# EAGLE design Motherboard (EAGLE 7.6.0)
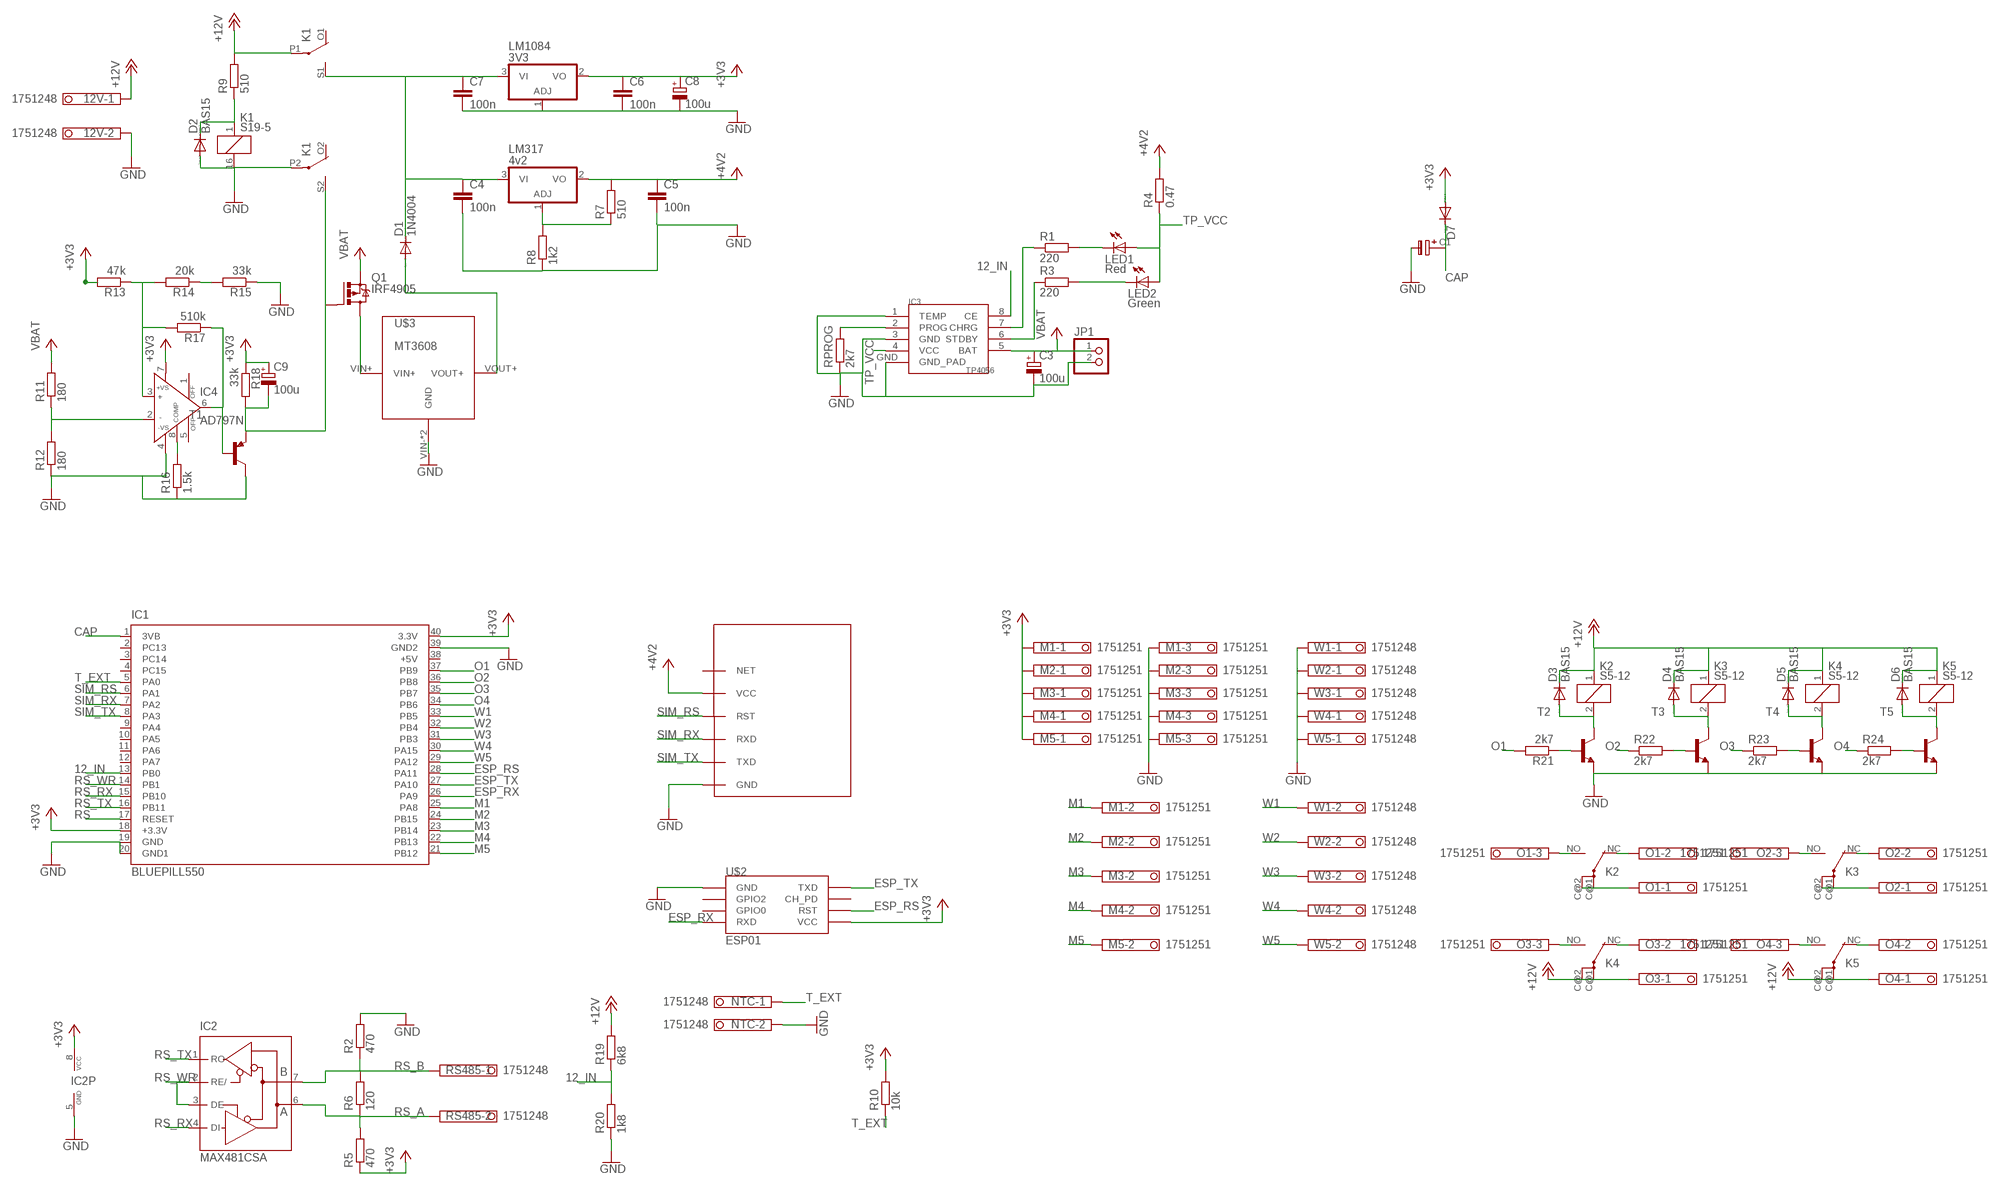
[diagram p0: schematic, sheet 1]

## Parts
12V  1751248  [1751248]
C1  CAP-13,5  [PAC-G-1]
C3  100u  CPOL-EUE2,5-6E  [E2,5-6E]
C4  100n  C-EUC2012  [C2012]
C5  100n  C-EUC2012  [C2012]
C6  100n  C-EUC2012  [C2012]
C7  100n  C-EUC2012  [C2012]
C8  100u  CPOL-EUE2,5-6E  [E2,5-6E]
C9  100u  CPOL-EUE2,5-6E  [E2,5-6E]
D1  1N4004  [DO41-10]
D2  BAS15  [DO34-7]
D3  BAS15  [DO34-7]
D4  BAS15  [DO34-7]
D5  BAS15  [DO34-7]
D6  BAS15  [DO34-7]
D7  BAS15  [DO34-7]
IC1  BLUEPILL550  [DIL40]
IC2  MAX481CSA  [SO08]
IC3  TP4056  [SOP-8]
IC4  AD797N  [DIL08]
JP1  PINHD-1X2  [1X02]
K1  S19-5  351  [351]
K2  S5-12  HY1-5V  [HY]
K3  S5-12  HY1-5V  [HY]
K4  S5-12  HY1-5V  [HY]
K5  S5-12  HY1-5V  [HY]
LED1  Red  LEDCHIP-LED0805  [CHIP-LED0805]
LED2  Green  LEDCHIP-LED0805  [CHIP-LED0805]
LM317  4v2  317T  [TO220H]
LM1084  3V3  317T  [TO220H]
M1  1751251  [1751251]
M2  1751251  [1751251]
M3  1751251  [1751251]
M4  1751251  [1751251]
M5  1751251  [1751251]
NTC  1751248  [1751248]
O1  1751251  [1751251]
O2  1751251  [1751251]
O3  1751251  [1751251]
O4  1751251  [1751251]
Q1  IRF4905  [TO220BH]
R1  220  R-EU_R0805  [R0805]
R2  470  R-EU_0204/5  [0204/5]
R3  220  R-EU_R0805  [R0805]
R4  0.47  R-EU_0207/12  [0207/12]
R5  470  R-EU_0204/5  [0204/5]
R6  120  R-EU_0204/7  [0204/7]
R7  510  R-EU_0204/7  [0204/7]
R8  1k2  R-EU_0204/7  [0204/7]
R9  510  R-EU_0204/7  [0204/7]
R10  10k  R-EU_0204/5  [0204/5]
R11  180  R-EU_0204/7  [0204/7]
R12  180  R-EU_0204/7  [0204/7]
R13  47k  R-EU_0204/7  [0204/7]
R14  20k  R-EU_0204/7  [0204/7]
R15  33k  R-EU_0204/7  [0204/7]
R16  1.5k  R-EU_0204/7  [0204/7]
R17  510k  R-EU_0204/7  [0204/7]
R18  33k  R-EU_0204/7  [0204/7]
R19  6k8  R-EU_0204/5  [0204/5]
R20  1k8  R-EU_0204/5  [0204/5]
R21  2k7  R-EU_0204/7  [0204/7]
R22  2k7  R-EU_0204/7  [0204/7]
R23  2k7  R-EU_0204/7  [0204/7]
R24  2k7  R-EU_0204/7  [0204/7]
RPROG  2k7  R-EU_0204/7  [0204/7]
RS485  1751248  [1751248]
T1  BC327-40-PNP-TO92-EBC  [TO92-EBC]
T2  -NPN-TO92-ECB  [TO92-ECB]
T3  -NPN-TO92-ECB  [TO92-ECB]
T4  -NPN-TO92-ECB  [TO92-ECB]
T5  -NPN-TO92-ECB  [TO92-ECB]
U$1  SIM800L  [SIM-CORE]
U$2  ESP01  [ESP01]
U$3  MT3608  [MT3608]
W1  1751248  [1751248]
W2  1751248  [1751248]
W3  1751248  [1751248]
W4  1751248  [1751248]
W5  1751248  [1751248]

## Nets
4V2: C5.1 LM317.2(VO) R4.2 R7.2 U$1.VCC ; supply symbol labelled +4V2
12_IN: IC1.13(PB0) IC3.8(CE) R19.1 R20.2
+3V3: C6.1 C8.+ C9.+ D7.A IC1.18(+3.3V) IC1.40(3.3V) IC2.8(VCC) IC4.7(+VS) LM1084.2(VO) M1.1 M2.1 M3.1 M4.1 M5.1 R5.1 R10.2 R13.2 R18.1 U$2.VCC
+12V: 12V.1 D3.C D4.C D5.C D6.C K1.P1(2:P) K2.1 K3.1 K4.1 K4.C@1(2:P) K4.C@2(2:P) K5.1 K5.C@1(2:P) K5.C@2(2:P) O3.1 O4.1 R9.2 R19.2
CAP: C1.+ D7.C IC1.1(3VB)
ESP_RS: IC1.28(PA11) U$2.RST
ESP_RX: IC1.26(PA9) U$2.RX(RXD)
ESP_TX: IC1.27(PA10) U$2.TX(TXD)
GND: 12V.2 C1.- C3.- C4.2 C5.2 C6.2 C7.2 C8.- D2.A IC1.19(GND) IC1.20(GND1) IC1.39(GND2) IC2.5(GND) IC3.1(TEMP) IC3.3(GND) IC3.GND(GND_PAD) IC4.4(-VS) JP1.2 K1.16 K1.P2(3:P) LM1084.1(ADJ) M1.3 M2.3 M3.3 M4.3 M5.3 NTC.2 R2.2 R8.1 R12.1 R15.1 R16.1 R20.1 RPROG.1 T1.C T2.E T3.E T4.E T5.E U$1.GND U$2.GND U$3.VIN-(GND) U$3.VOUT-(GND) W1.1 W2.1 W3.1 W4.1 W5.1
M1: IC1.25(PA8) M1.2
M2: IC1.24(PB15) M2.2
M3: IC1.23(PB14) M3.2
M4: IC1.22(PB13) M4.2
M5: IC1.21(PB12) M5.2
N$1: IC3.2(PROG) RPROG.2
N$2: D2.C K1.1 R9.1
N$3: LED1.C R1.2
N$4: LED2.C R3.2
N$5: IC3.7(CHRG) R1.1
N$6: IC3.6(STDBY) R3.1
N$7: C4.1 C7.1 D1.C K1.S1(2:S) LM317.3(VI) LM1084.3(VI)
N$8: Q1.D U$3.VIN+
N$9: IC4.3(IN+) R13.1 R14.2 R17.2
N$11: IC4.2(IN-) R11.1 R12.2
N$12: IC4.8(COMP) R16.2
N$13: IC4.6(OUT) R17.1 T1.B
N$14: LM317.1(ADJ) R7.1 R8.2
N$15: C9.- K1.S2(3:S) Q1.G R18.2 T1.E
N$19: R24.2 T5.B
N$20: R23.2 T4.B
N$21: R22.2 T3.B
N$22: R21.1 T2.B
N$23: K4.NO(2:S) O3.3
N$24: K4.NC(2:O) O3.2
N$25: K5.NO(2:S) O4.3
N$26: K5.NC(2:O) O4.2
N$27: K2.NO(2:S) O1.3
N$28: K2.C@1(2:P) K2.C@2(2:P) O1.1
N$29: K2.NC(2:O) O1.2
N$30: K3.NO(2:S) O2.3
N$31: K3.NC(2:O) O2.2
N$32: K3.C@1(2:P) K3.C@2(2:P) O2.1
N$33: R14.1 R15.2
N$34: D6.A K5.2 T5.C
N$35: D3.A K2.2 T2.C
N$36: D4.A K3.2 T3.C
N$37: D5.A K4.2 T4.C
O1: IC1.37(PB9) R21.2
O2: IC1.36(PB8) R22.1
O3: IC1.35(PB7) R23.1
O4: IC1.34(PB6) R24.1
RS: IC1.17(RESET)
RS_A: IC2.6(A) R5.2 R6.1 RS485.2
RS_B: IC2.7(B) R2.1 R6.2 RS485.1
RS_RX: IC1.15(PB10) IC2.4(DI)
RS_TX: IC1.16(PB11) IC2.1(RO)
RS_WR: IC1.14(PB1) IC2.2(RE/) IC2.3(DE)
SIM_RS: IC1.6(PA1) U$1.RST
SIM_RX: IC1.7(PA2) U$1.RXD
SIM_TX: IC1.8(PA3) U$1.TXD
T_EXT: IC1.5(PA0) NTC.1 R10.1
TP_VCC: IC3.4(VCC) LED1.A LED2.A R4.1
VBAT: C3.+ IC3.5(BAT) JP1.1 Q1.S R11.2
VOUT+: D1.A U$3.VOUT+
W1: IC1.33(PB5) W1.2
W2: IC1.32(PB4) W2.2
W3: IC1.31(PB3) W3.2
W4: IC1.30(PA15) W4.2
W5: IC1.29(PA12) W5.2
Unconnected: IC1.2(PC13) IC1.3(PC14) IC1.4(PC15) IC1.9(PA4) IC1.10(PA5) IC1.38(+5V) IC4.1(OFF) IC4.5(OFF) K1.O1(2:O) K1.O2(3:O) U$1.NET U$2.CH_PD U$2.GPIO0 U$2.GPIO2

## Power pins joined to a net without a drawn wire
PA6: IC1.11(PA6)
PA7: IC1.12(PA7)

## Library data of the parts
12V NTC RS485 W1-W5 = con-phoenix-350:1751248: MKDS 1/ 2-3,5 Printklemme Nennstrom: 10 A Bemessungsspannung: 160 V Raster: 3,5 mm Polzahl: 2 Montageart: Löten Anschlussart: Schraubanschluss Anschlussrichtung vom Leiter zur Platine: 0° Source: http://eshop.phoenixcontact.com .. 1751248.pdf; OC_FARNELL: unknown; OC_NEWARK: unknown
C1 = Cap-Gold:CAP-13,5
C3 C8 C9 = resistor:CPOL-EU: POLARIZED CAPACITOR, European symbol
C4-C7 = resistor:C-EU: CAPACITOR, European symbol
D1 = diode:1N4004: DIODE general purpose rectifier, 1 A
D2-D7 = diode:BAS15: DIODE high speed
IC1 = STM32BluePill:BLUEPILL: BluePill STM32F108T6 Dev Board Source: http://www.stm32duino.com; 0: x; BLUEP: 1; MF: BluePill; MPN: BluePill; X: 0
IC2 = maxim:MAX481CSA: RS485 TRANSEIVER; MF: MAXIM; MPN: MAX481CSA; OC_FARNELL: unknown; OC_NEWARK: 90C3817
IC3 = TP4056_2:TP4056
IC4 = analog-devices:AD797: Ultralow Distortion, Ultralow Noise Op Amp Source: http://www.analog.com/static/imported-files/data_sheets/AD797.pdf; MF: ALTERA CORPORATION; MPN: AD797ANZ; OC_FARNELL: 9603778; OC_NEWARK: 59K6088
JP1 = pinhead:PINHD-1X2: PIN HEADER
K1 = relay:351: RELAY 2 x switch, Omron; OC_FARNELL: unknown; OC_NEWARK: unknown
K2-K5 = relay:HY1*: Non-polarized 1 Form C Relay NAiS Source: http://www.mew-europe.com/.. en_ds_61012_0000.pdf; MF: AROMAT/ MATSUSHITA; MPN: HY1-5V; OC_FARNELL: unknown; OC_NEWARK: 10C6692
LED1 LED2 = led:LED: LED OSRAM: - CHIPLED LG R971, LG N971, LY N971, LG Q971, LY Q971, LO R971, LY R971 LH N974, LH R974 LS Q976, LO Q976, LY Q976 LO Q996 - Hyper CHIPLED LW Q18S LB Q993, LB Q99A, LB R99A - SideLED LS A670, LO A670, LY A670, LG A670, LP A670 LB A673, LV A673, LT A673, LW A673 LH A674 LY A675 LS A676, LA A676, LO A676, LY A676, LW A676 LS A679, LY A679, LG A679 - Hyper Micro SIDELED® LS Y876, LA Y876, LO Y876, LY Y876 LT Y87S - SmartLED LW L88C, LW L88S LB L89C, LB L89S, LG L890 LS L89K, LO L89K, LY L89K LS L896, LA L896, LO L896, LY L896 - TOPLED LS T670, LO T670, LY T670, LG T670, LP T670 LSG T670, LSP T670, LSY T670, LOP T670, LYG T670 LG T671, LOG T671, LSG T671 LB T673, LV T673, LT T673, LW T673 LH T674 LS T676, LA T676, LO T676, LY T676, LB T676, LH T676, LSB T676, LW T676 LB T67C, LV T67C, LT T67C, LS T67K, LO T67K, LY T67K, LW E67C LS E67B, LA E67B, LO E67B, LY E67B, LB E67C, LV E67C, LT E67C LW T67C LS T679, LY T679, LG T679 LS T770, LO T770, LY T770, LG T770, LP T770 LB T773, LV T773, LT T773, LW T773 LH T774 LS E675, LA E675, LY E675, LS T675 LS T776, LA T776, LO T776, LY T776, LB T776 LHGB T686 LT T68C, LB T68C - Hyper Mini TOPLED® LB M676 - Mini TOPLED Santana® LG M470 LS M47K, LO M47K, LY M47K Source: http://www.osram.convergy.de LUXEON: - LUMILED® LXK2-PW12-R00, LXK2-PW12-S00, LXK2-PW14-U00, LXK2-PW14-V00 LXK2-PM12-R00, LXK2-PM12-S00, LXK2-PM14-U00 LXK2-PE12-Q00, LXK2-PE12-R00, LXK2-PE12-S00, LXK2-PE14-T00, LXK2-PE14-U00 LXK2-PB12-K00, LXK2-PB12-L00, LXK2-PB12-M00, LXK2-PB14-N00, LXK2-PB14-P00, LXK2-PB14-Q00 LXK2-PR12-L00, LXK2-PR12-M00, LXK2-PR14-Q00, LXK2-PR14-R00 LXK2-PD12-Q00, LXK2-PD12-R00, LXK2-PD12-S00 LXK2-PH12-R00, LXK2-PH12-S00 LXK2-PL12-P00, LXK2-PL12-Q00, LXK2-PL12-R00 Source: www.luxeon.com KINGBRIGHT: KA-3528ASYC Source: www.kingbright.com
LM317 LM1084 = linear:*317: Positive VOLTAGE REGULATOR
M1-M5 O1-O4 = con-phoenix-350:1751251: MKDS 1/ 3-3,5 Printklemme Nennstrom: 10 A Bemessungsspannung: 160 V Raster: 3,5 mm Polzahl: 3 Montageart: Löten Anschlussart: Schraubanschluss Anschlussrichtung vom Leiter zur Platine: 0° Source: http://eshop.phoenixcontact.com .. 1751251.pdf; OC_FARNELL: unknown; OC_NEWARK: unknown
Q1 = transistor-power:IRF4905: P-Channel HEXFET® Power MOSFET RDS(on)= 0.02 Ohm, ID = -74A Source: http://www.irf.com/product-info/datasheets/data/irf4905pbf.pdf
R1-R9 R11-R18 R21-R24 RPROG = resistor:R-EU_: RESISTOR, European symbol
R10 R19 R20 = rcl:R-EU_: RESISTOR, European symbol
T1 = transistor:*-PNP-: PNP Transistror
T2-T5 = transistor:*-NPN-: NPN Transistror BF959 corrected 2008.03.06
U$1 = SIM800L:SIM800L
U$2 = ESP_8266:ESP01: ESP8266 Wifi module 01
U$3 = dc-dc-converter2:MT3608

## Board
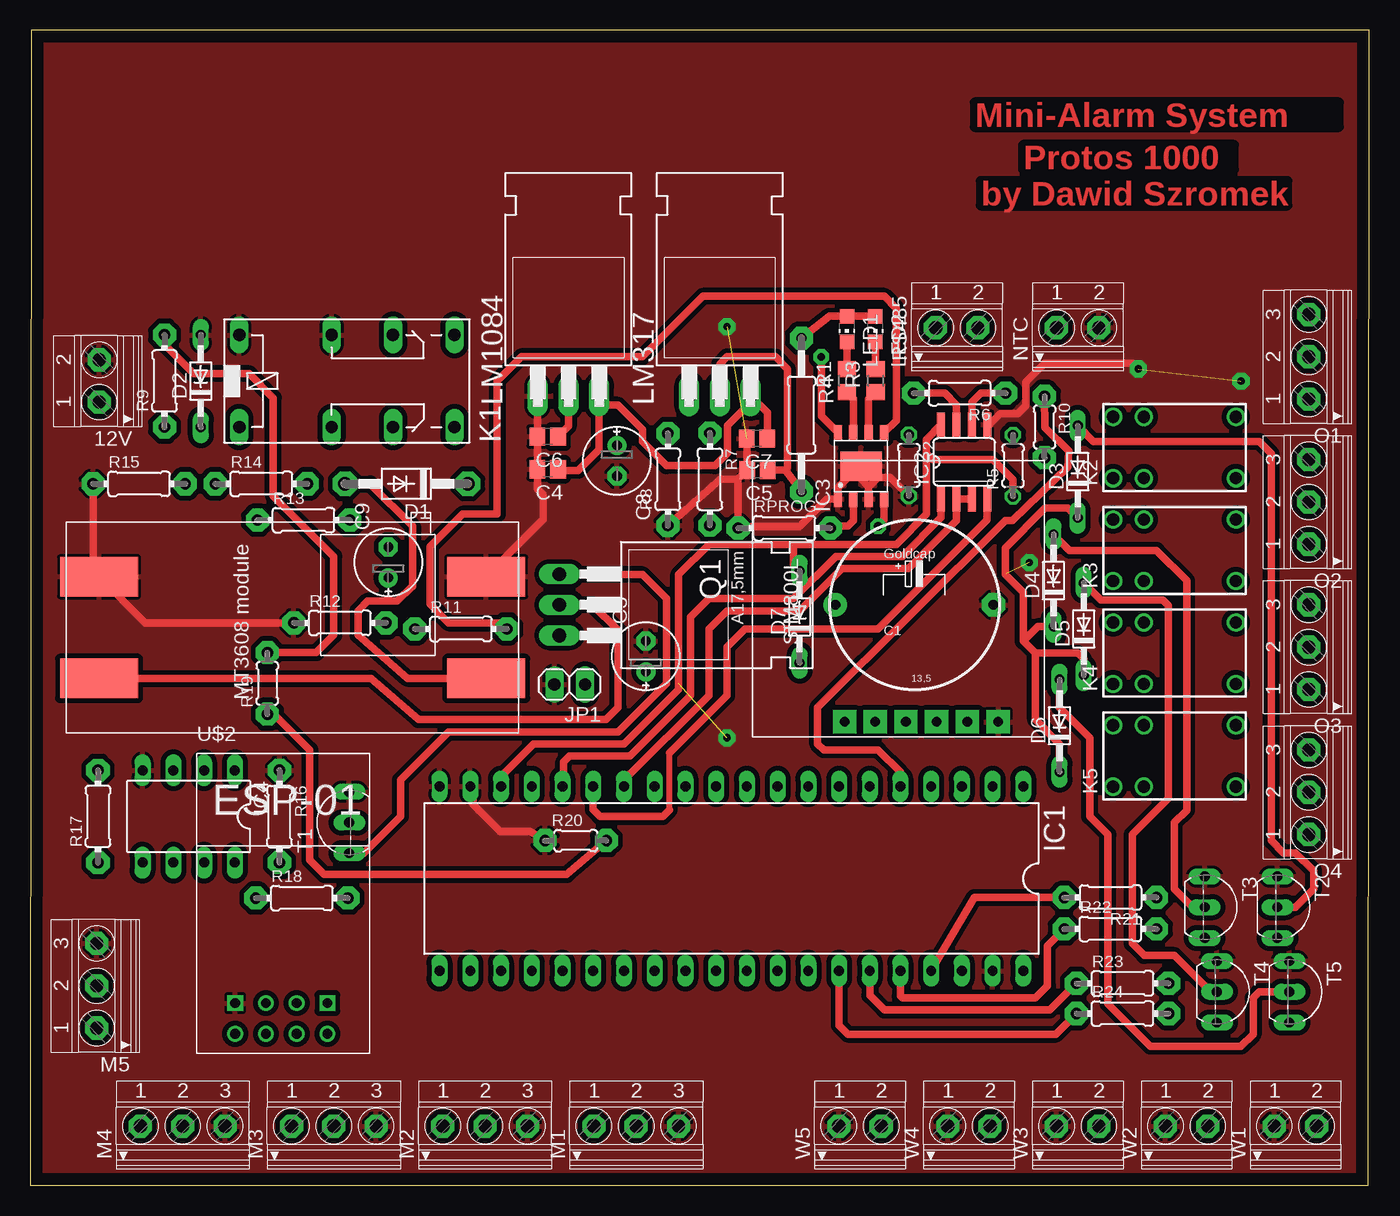
[diagram p1: board, top side]
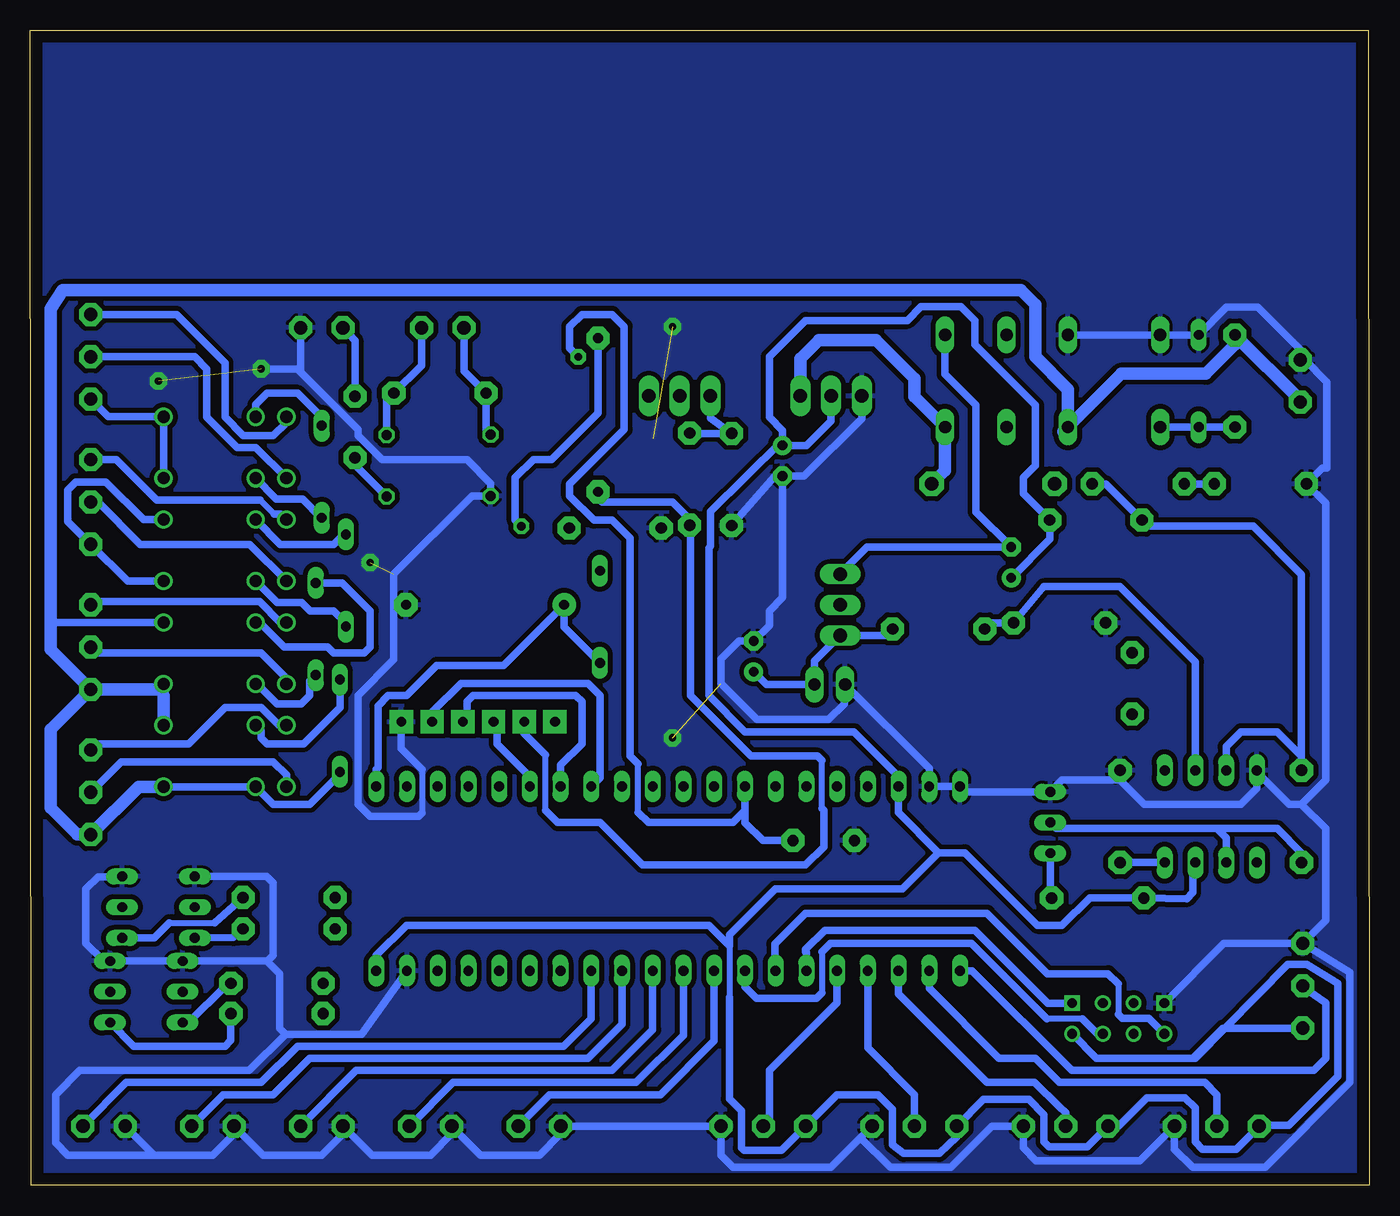
[diagram p2: board, bottom side, seen from below]

Size 110.7 x 95.5 mm. Coordinates in mm from the lower left corner, seen from the top.
Outline: 0,0 110.6,0 110.7,95.5 0.1,95.5 0,0
Copper layers (1*16): Top 0.035mm / dielectric 1.5mm / Bottom 0.035mm
Design rules "default": minimum track width 10mil, minimum drill 24mil, track to track 8mil, track to pad 8mil, pad to pad 8mil, via to via 8mil, smd to smd 8mil, copper to edge 40mil, drill to drill 8mil, minimum pad ring 10mil, minimum via ring 8mil, stop-mask expansion 4mil, vias tented up to drill 0mil, thermal gap 10mil

### Footprints (pad centres in the part's own frame; a part is rotated, then mirrored left to right if it is on the bottom)
1751248 = drill 1.1 pad 1.905 octagon: 1 -1.75,-0.1; 2 1.75,-0.1
PAC-G-1 = drill 0.813 pad 1.93: + -6.54,0 | drill 0.813 pad 1.93 octagon: - 6.54,0
E2,5-6E = drill 0.813 pad 1.575: + -1.27,0 | drill 0.813 pad 1.575 octagon: - 1.27,0
C2012 = smd 1.3 x 1.5: 1 -0.85,0; 2 0.85,0
DO41-10 = drill 1.118 pad 2.032 octagon: A 5.08,0; C -5.08,0
DO34-7 = drill 0.813 long: A 3.81,0; C -3.81,0
DIL40 = drill 0.813 long: 1 -24.13,-7.62; 2 -21.59,-7.62; 3 -19.05,-7.62; 4 -16.51,-7.62; 5 -13.97,-7.62; 6 -11.43,-7.62; 7 -8.89,-7.62; 8 -6.35,-7.62; 9 -3.81,-7.62; 10 -1.27,-7.62; 11 1.27,-7.62; 12 3.81,-7.62; 13 6.35,-7.62; 14 8.89,-7.62; 15 11.43,-7.62; 16 13.97,-7.62; 17 16.51,-7.62; 18 19.05,-7.62; 19 21.59,-7.62; 20 24.13,-7.62; 21 24.13,7.62; 22 21.59,7.62; 23 19.05,7.62; 24 16.51,7.62; 25 13.97,7.62; 26 11.43,7.62; 27 8.89,7.62; 28 6.35,7.62; 29 3.81,7.62; 30 1.27,7.62; 31 -1.27,7.62; 32 -3.81,7.62; 33 -6.35,7.62; 34 -8.89,7.62; 35 -11.43,7.62; 36 -13.97,7.62; 37 -16.51,7.62; 38 -19.05,7.62; 39 -21.59,7.62; 40 -24.13,7.62
SO08 = smd 0.66 x 2.032: 1 -1.905,-3.073; 2 -0.635,-3.073; 3 0.635,-3.073; 4 1.905,-3.073; 5 1.905,3.073; 6 0.635,3.073; 7 -0.635,3.073; 8 -1.905,3.073
SOP-8 = smd 1.3 x 0.7: 1 -2.75,1.905; 2 -2.75,0.635; 3 -2.75,-0.635; 4 -2.75,-1.905; 5 2.75,-1.905; 6 2.75,-0.635; 7 2.75,0.635; 8 2.75,1.905 | smd 2.413 x 3.429: GND 0,0
DIL08 = drill 0.813 long: 1 -3.81,-3.81; 2 -1.27,-3.81; 3 1.27,-3.81; 4 3.81,-3.81; 5 3.81,3.81; 6 1.27,3.81; 7 -1.27,3.81; 8 -3.81,3.81
1X02 = drill 1.016 long: 1 -1.27,0; 2 1.27,0
351 = drill 1.016 long: 1 -3.81,-3.81; 16 -3.81,3.81; O1 8.89,-3.81; O2 8.89,3.81; P1 3.81,-3.81; P2 3.81,3.81; S1 13.97,-3.81; S2 13.97,3.81
HY = drill 1: 1 -2.54,-2.54; 2 -2.54,2.54; C@1 5.08,2.54; C@2 5.08,-2.54; NC -5.08,-2.54; NO -5.08,2.54
CHIP-LED0805 = smd 1.2 x 1.2: A 0,-1.05; C 0,1.05
TO220H = drill 1.118 long: 1 -2.54,-10.16; 2 0,-10.16; 3 2.54,-10.16
1751251 = drill 1.1 pad 1.905 octagon: 1 -3.5,-0.1; 2 0,-0.1; 3 3.5,-0.1
TO220BH = drill 1.118 long: D 0,-6.35; G -2.54,-6.35; S 2.54,-6.35
R0805 = smd 1.3 x 1.5: 1 -0.95,0; 2 0.95,0
0204/5 = drill 0.813 octagon: 1 -2.54,0; 2 2.54,0
0207/12 = drill 0.813 pad 1.905 octagon: 1 -6.35,0; 2 6.35,0
0204/7 = drill 0.94 pad 1.905 octagon: 1 -3.81,0; 2 3.81,0
0204/5' = drill 0.94 pad 1.905 octagon: 1 -2.54,0; 2 2.54,0
TO92-EBC = drill 0.813 long: B 0,-1.27; C 2.54,-1.27; E -2.54,-1.27
TO92-ECB = drill 0.813 long: B 2.54,0; C 0,0; E -2.54,0
SIM-CORE = drill 0.8 pad 1.93 square: GND 1.27,3.81; NET 1.27,16.51; RST 1.27,11.43; RXD 1.27,8.89; TXD 1.27,6.35; VCC 1.27,13.97
ESP01 = drill 0.8: CH_PD -1.285,-8.178; GPIO0 1.255,-5.638; GPIO2 -1.285,-5.638; RST 1.255,-8.178; TX -3.825,-8.178; VCC 3.795,-8.178 | drill 0.8 square: GND -3.825,-5.638; RX 3.795,-5.638
MT3608 = smd 3.251 x 6.452: VIN+ -4.2,16; VIN- 4.2,16; VOUT+ -4.2,-16; VOUT- 4.2,-16

### Placement (x,y rotation side)
12V  5.6,66.5 90 top
C1  73.1,48 0 top
C3  50.89,43.73 90 top
C4  42.78,59.2 180 top
C5  60.13,59.15 180 top
C6  42.78,61.9 180 top
C7  60.08,61.75 180 top
C8  48.5,59.91 270 top
C9  29.6,51.5 90 top
D1  31.1,58 180 top
D2  14.1,66.5 90 top
D3  86.6,59 90 top
D4  84.6,50 90 top
D5  87.1,46 90 top
D6  85.1,38 90 top
D7  63.6,47 90 top
IC1  57.97,25.36 180 top
IC2  77.21,59.81 0 top
IC3  68.68,59.47 90 top
IC4  13.1,30.5 180 top
JP1  44.6,41.41 180 top
K1  21.1,66.5 0 top
K2  94.6,61 0 top
K3  94.6,52.5 0 top
K4  94.6,44 0 top
K5  94.6,35.5 0 top
LED1  67.52,70.8 180 top
LED2  69.87,70.8 180 top
LM317  57.01,75.43 0 top
LM1084  44.5,75.43 0 top
M1  50.1,5 0 top
M2  37.6,5 0 top
M3  25.1,5 0 top
M4  12.6,5 0 top
M5  5.4,16.5 90 top
NTC  86.6,71 0 top
O1  105.6,68.5 90 top
O2  105.6,56.5 90 top
O3  105.6,44.5 90 top
O4  105.6,32.5 90 top
Q1  50.1,48 270 top
R1  67.51,66.53 90 top
R2  72.63,59.53 270 top
R3  69.89,66.53 90 top
R4  63.76,63.69 270 top
R5  81.25,59.5 90 top
R6  76.83,65.5 180 top
R7  56.19,58.39 270 top
R8  52.72,58.36 90 top
R9  11.1,66.5 90 top
R10  10k  [0204/5']  83.85,62.7 270 top
R11  35.6,46 0 top
R12  25.6,46.5 0 top
R13  22.6,55 0 top
R14  19.1,58 0 top
R15  9,58 0 top
R16  20.6,30.5 270 top
R17  5.6,30.5 90 top
R18  22.45,23.75 0 top
R19  6k8  [0204/5']  19.6,41.5 90 top
R20  1k8  [0204/5']  45.1,28.5 0 top
R21  89.3,23.8 180 top
R22  89.3,21.2 0 top
R23  90.3,16.7 0 top
R24  90.3,14.2 0 top
RPROG  62.34,54.34 0 top
RS485  76.6,71 0 top
T1  25.1,30 90 top
T2  103.1,23 270 top
T3  97.1,23 270 top
T4  98.1,16 270 top
T5  104.1,16 270 top
U$1  83.83,37.06 90 top
U$2  20.77,20.7 0 top
U$3  21.69,46.12 90 top
W1  104.6,5 0 top
W2  95.6,5 0 top
W3  86.6,5 0 top
W4  77.6,5 0 top
W5  68.6,5 0 top

### Tracks (layer width: path | path; a pad name or v marks a point on that pad's centre or on a via)
4V2
  Top 0.61: R4.2 62.45,59.15 | 62.45,59.15 C5.1 | LM317.2 57.01,67.91 57.6,68.5 61.6,68.5 62.6,67.5 62.6,59.3 62.45,59.15
  Bottom 0.508: 68.1,31 68.1,35.6 | 45.25,31.15 45.25,35.15
  Bottom 0.61: R7.2 55.99,54.89 57.6,56.5 63.42,56.5 R4.2 | R7.2 55.99,54.42 | 68.1,35.6 69.86,37.36 U$1.VCC | 68.1,31 67.1,30 63.6,30 60.1,26.5 46.6,26.5 45.1,28 45.1,31 45.25,31.15 | 45.25,35.15 45.6,35.5 51.1,35.5 56.1,40.5 56.1,54.42 R7.2
12_IN  (via drill 0.6 pad 1.27)
  Top 0.61: R19.1 20.14,38.96 23.1,36 23.1,26.9 24.3,25.7 44.34,25.7 R20.2 | v65.4,68.5 65.4,63.59 IC3.8
  Bottom 0.508: 60.45,30.85 60.45,34.85
  Bottom 0.61: R20.2 50.14,28.5 51.62,29.98 IC1.13 51.6,32.96 51.6,31 52.6,30 59.6,30 60.45,30.85 | 60.45,34.85 61.1,35.5 61.1,53.5 62.6,55 64.1,55 66.1,57 66.1,58 61.6,62.5 61.6,71 62.6,72 65.1,72 66.1,71 66.1,69.2 v65.4,68.5
+3V3
  Top 0.61: LM1084.2 44.5,62.77 C6.1 | IC2.8 74.1,61.68 74.1,60.5 | 74.1,60.5 74.1,55.5 71.6,53 63.1,53 | 63.1,53 56.1,53 53.6,50.5 53.6,41 49.1,36.5 41.6,36.5 38.92,33.82 IC1.18 | R5.1 81.25,58.35 79.6,60 74.6,60 74.1,60.5 | D7.A 63.1,51.31 63.1,53
  Bottom 0.508: 52.9,19.8 52.9,15.49
  Bottom 0.61: C8.+ 46.52,61.18 44.5,63.2 LM1084.2 | C9.+ 26.41,53.42 R13.2 28.6,57.19 28.6,58.5 27.6,59.5 27.6,64.5 32.6,69.5 32.6,71.5 33.75,72.65 37.05,72.65 38.2,71.5 46.6,71.5 49.6,68.5 49.6,63.5 48.5,62.4 C8.+ | IC4.7 14.6,26.46 14.6,24.2 15.1,23.7 R18.1 23.1,23.75 25.4,21.5 27.44,21.5 33.44,27.5 35.6,27.5 | U$2.VCC 22.54,10.5 14.6,10.5 | 14.6,10.5 12.1,13 M5.1 | 35.6,27.5 38.92,30.82 IC1.18 38.92,33.82 42.6,37.5 51.6,37.5 54.6,40.5 54.6,52.7 54.45,52.85 54.45,55.7 48.6,61.5 48.6,61.28 C8.+ | 52.9,15.49 52.91,15.54 52.9,7.15 51.9,6.15 51.9,3.1 51.7,2.9 48.6,2.9 M1.1 44,7.5 40.6,7.5 39.4,6.3 39.4,3.35 38.5,2.65 35.55,2.65 34.1,4 M2.1 31.9,7.1 28.15,7.1 26.9,5.85 26.9,3.6 26.5,3.2 23.3,3.2 M3.1 20.75,4.9 18.4,7.25 15.25,7.25 14.4,6.4 14.4,3.6 13.8,3 11,3 M4.1 9.05,4.95 6.65,4.95 2.6,9 2.6,16.7 5.15,18.25 6.75,18.25 14.4,10.5 14.6,10.5 | IC1.40 82.1,19 79.6,21.5 54.6,21.5 52.9,19.8 52.9,20.7 49.1,24.5 38.6,24.5 35.6,27.5 | R10.2 83.85,59.56 R5.1
+12V
  Top 0.61: R19.2 23.64,44.04 25.1,45.5 25.1,52 20.1,57 20.1,65.1 18.1,67.1 13.5,67.1 11.1,69.5 R9.2 | D3.C 85.79,56 83.9,56 80.6,52.7 80.6,50.5 82.1,49 82.1,45 | D4.C 83.29,46.19 82.1,45 | 82.1,45 83.1,44 | 83.1,44 86.6,44 87.1,43.5 D5.C | D6.C 85.1,36.5 83.1,38.5 83.1,44
  Bottom 0.61: 12V.1 5.7,64.91 | R9.2 11.1,69.5 | 100.14,41 100.2,41 99.68,40.48 | K4.C@1 108.96,46.54 109,46.5 | D3.C 86.64,55.19 88.2,56.75 90.35,56.75 K2.1 | K3.1 90.3,48.2 88.25,48.2 87.55,47.5 85.6,47.5 84.6,46.5 D4.C | K4.1 91.96,41.46 90.3,39.8 88.3,39.8 87.6,40.5 87.6,41.69 D5.C | D6.C 85.1,34 87.6,31.5 90.6,31.5 K5.1 K5.C@2
  Bottom 1.016: 5.7,64.91 R9.2 | 11.1,69.5 13.5,67.1 20.5,67.1 K1.P1 | 25.3,62.3 K1.P1 | K1.P1 24.91,65.81 27.6,68.5 27.6,72.8 28.8,74 108,74 109,72.5 109,46.5 109,44.3 O3.1 | O3.1 100.2,41 | 100.14,41 K4.C@2 | O3.1 109,37.7 109,31.2 106.8,29 O4.1 101.74,32.96 K5.C@2 | K5.C@1 99.68,40.48
CAP
  Bottom 0.61: IC1.1 82.1,34.4 81.95,34.55 81.95,39.65 81.1,40.5 79.6,40.5 77.1,43 71.56,43 C1.+ 66.56,46.15 D7.C
ESP_RS
  Bottom 0.508: 23.7,13.75 26.65,13.75 | 45.25,19.3 45.25,15.9
  Bottom 0.61: U$2.RST 22.47,12.52 23.7,13.75 | 26.65,13.75 32.9,20 44.55,20 45.25,19.3 | 45.25,15.9 45.7,15.45 50.65,15.45 51.6,16.4 51.6,17.72 IC1.28
ESP_RX
  Bottom 0.61: IC1.26 46.54,19.26 46.6,19.32 46.6,19.5 45,21.1 32.6,21.1 26.57,15.06 U$2.RX
ESP_TX
  Bottom 0.508: 20.75,16.65 20.75,14.15
  Bottom 0.61: U$2.TX 18.22,13.8 20.4,13.8 20.75,14.15 | IC1.27 49.15,17.81 49.15,19.95 46.6,22.5 31.6,22.5 26.6,17.5 21.6,17.5 20.75,16.65
GND  (via drill 0.6 pad 1.42)  (4 unrouted)
  Top 0.61: 4.79,51.22 5.19,50.82 | 5.19,50.82 U$3.VIN- 9.51,46.5 R12.1 | LM1084.1 41.96,61.93 C6.2 C4.2 41.93,57.57 42.4,57.1 42.4,55.03 U$3.VOUT- | R15.1 5.19,50.82 | IC1.19 36.6,32.76 36.6,31.5 38.85,29.25 41.31,29.25 R20.1 | C7.2 C5.2 58.53,58.4 | 58.53,58.4 RPROG.1 58.64,54.45 63.6,54.45 65.87,56.72 IC3.1 66.77,57.67 67.6,58.5 68.6,58.5 | 68.6,58.5 69.31,57.78 IC3.3 69.31,57.72 70.1,58.5 71.12,58.5 R2.2 | IC2.5 79.28,62.88 80.2,63.8 81.65,63.8 82.3,64.45 82.3,66.4 83.9,68 91.1,68 v91.6,67.5 | R8.1 57.07,58.4 58.53,58.4 | 68.6,58.5 68.6,59.39 IC3.GND
  Bottom 0.508: 78.3,34.4 78.3,30.8
  Bottom 0.61: K1.P2 K1.16 D2.A 11.81,72.6 9.2,72.6 5.7,69.1 12V.2 5.35,68.25 3.5,66.4 3.5,59.29 3.9,59.29 R15.1 3.6,56.41 3.6,33.5 5.6,31.5 | C8.- 46.72,58.64 41.96,63.4 LM1084.1 | 5.6,31.5 6.6,31.5 9.29,34.19 IC4.4 9.29,32.81 10.6,31.5 18.6,31.5 20.6,33.5 | R16.1 20.6,33.5 | 20.6,33.5 25.41,33.5 T1.C 33.4,32.54 IC1.20 IC1.19 36.38,34.46 JP1.2 43.4,41.34 43.4,39.8 44.7,38.5 50.6,38.5 53.6,41.5 53.6,43.5 52.1,45 C3.- 49.6,46.29 49.6,47.5 48.5,48.6 C8.- | M5.3 3.6,21.9 3.6,29.5 5.6,31.5 | M5.3 5.1,20 | 16.88,15 U$2.GND 12.01,20 M5.3 | C8.- 49.13,58.64 R8.1 | 42.05,3.95 44.5,1.5 52.6,1.5 53.6,2.5 M1.3 W5.1 66.85,4.25 68.6,2.5 73.45,2.5 W4.1 75.85,4.25 77.6,2.5 82.45,2.5 W3.1 84.85,4.25 86.6,2.5 91.45,2.5 W2.1 93.85,4.25 95.6,2.5 100.45,2.5 | 42.05,3.95 M2.3 | 42.05,3.95 39.6,1.5 34.6,1.5 31.2,4.9 M3.3 28.6,3.1 27.55,2.05 18.95,2.05 M4.3 16.1,3 14.6,1.5 8.6,1.5 1.6,8.5 1.6,17.6 M5.3 | 100.45,2.5 W1.1 | IC1.39 83.3,12.5 89.6,12.5 | 89.6,12.5 92.6,9.5 106.6,9.5 108.6,7.5 108.6,3.5 107.6,2.5 100.45,2.5 | C1.- 79.64,47.77 80.64,47.77 | U$1.GND 80.02,36.12 78.3,34.4 | 78.3,30.8 78.6,30.5 82.6,30.5 83.6,31.5 83.6,40.5 80.64,43.46 80.64,47.77 | 80.64,47.77 80.64,50.54 74.19,56.99 R2.2 72.63,58.03 74.6,60 81.6,60 83.6,62 83.6,62.5 88.35,67.25 | 91.1,18.5 91.14,18.54 T4.E T5.E 104.64,18.54 106.1,20 106.1,24.5 105.1,25.5 102.64,25.5 T2.E | 91.1,18.5 90.1,17.5 90.1,13 89.6,12.5 | T3.E 91.14,25.54 90.6,25 90.6,19 91.1,18.5 | NTC.2 88.35,67.25 | v91.6,67.5 88.6,67.5 88.35,67.25
  other vias: 100.1,66.5 57.6,37 57.6,71 82.6,51.5
  pour Bottom (isolate 0.406): 0.1,95.5 110.6,95.5 110.6,0 0.1,0
  pour Top (isolate 0.406): 0.1,95.5 110.6,95.5 110.6,0 0.1,0
M1
  Bottom 0.61: IC1.25 44,15.1 49.6,9.5 49.6,5.4 M1.2
M2
  Bottom 0.61: IC1.24 41.46,11.36 37.6,7.5 M2.2
M3
  Bottom 0.61: IC1.23 38.92,15.82 31.6,8.5 27.7,8.5 25.6,6.5 25.1,6 M3.2
M4
  Bottom 0.61: IC1.22 36.38,16.28 30.6,10.5 27.6,10.5 25.6,8.5 13.6,8.5 12.6,7.5 M4.2
M5
  Bottom 0.61: IC1.21 32.84,17.74 24.6,9.5 4.6,9.5 3.6,10.5 3.6,15.1 5.5,16.4 M5.2
N$1
  Top 0.61: RPROG.2 66.31,54.5 67.6,54.5 68.04,54.94 IC3.2
N$2
  Bottom 0.61: R9.1 13.4,62.69 D2.C K1.1
N$3
  Top 0.61: LED1.C R1.2
N$4
  Top 0.61: LED2.C 69.89,69.73 R3.2
N$5
  Top 0.61: IC3.7 68.04,65.05 R1.1
N$6
  Top 0.61: R3.1 69.31,65 IC3.6
N$7
  Top 0.61: C4.1 43.73,59.1 45.3,59.1 47.04,60.84 LM1084.3 47.81,64.5 48.6,64.5 50.6,62.5 50.6,61.5 52.6,59.5 56.6,59.5 57.65,60.55 57.65,62.8 59.55,64.7 LM317.3 60.93,63.89 C7.1
  Bottom 1.016: D1.C 35.07,59.11 K1.S1 37.6,65.22 37.6,66.7 40.8,69.9 45.5,69.9 47.04,68.36 LM1084.3
N$8
  Top 0.61: 43.25,47.5 Q1.D 46.5,48 48.6,45.9 48.6,39.5 47.6,38.5 32.1,38.5 28.18,41.92 U$3.VIN+
N$9
  Bottom 0.61: R14.2 21.79,58 R13.1 18.29,54.5 9.6,54.5 5.6,50.5 R17.2 5.6,35.5 7.6,37.5 10.6,37.5 11.83,36.27 IC4.3
N$11
  Bottom 0.61: IC4.2 14.37,43.27 20.6,49.5 26.91,49.5 R12.2 31.29,46.5 R11.1
N$12
  Bottom 0.61: IC4.8 R16.2
N$13
  Bottom 0.61: IC4.6 11.83,28.73 12.6,29.5 | 12.6,29.5 25.87,29.5 T1.B | R17.1 5.6,27.5 7.6,29.5 12.6,29.5
N$14
  Bottom 0.61: R7.1 55.77,62.17 R8.2 54.47,63.42 LM317.1
N$15
  Top 0.61: T1.E 27.56,27.46 30.6,30.5 30.6,33.5 34.6,37.5 48.6,37.5 52.6,41.5 52.6,48.5 50.6,50.5 43.79,50.5 Q1.G
  Bottom 0.61: K1.S2 35.07,67.07 32.5,64.5 32.5,55.67 C9.- 41.52,52.77 Q1.G | T1.E 26.37,24.04 R18.2
N$19
  Bottom 0.61: R24.2 94.11,11.99 94.6,11.5 102.14,11.5 T5.B
N$20
  Bottom 0.61: T4.B 97.59,13.46 94.56,16.49 R23.2
N$21
  Bottom 0.61: R22.2 93.91,20.5 T3.B
N$22
  Bottom 0.508: 99.2,21.7 95.46,21.7
  Bottom 0.61: T2.B 100.44,20.46 99.2,21.7 | 95.46,21.7 R21.1
N$23
  Bottom 0.61: K4.NO 90.04,46.54 91.75,48.25 105.45,48.25 O3.3
N$24
  Bottom 0.61: K4.NC 89.52,41.92 91.6,44 105.2,44 O3.2
N$25
  Bottom 0.61: K5.NO 90.14,38.04 91.6,39.5 94.6,39.5 97.6,36.5 105.2,36.5 O4.3
N$26
  Bottom 0.61: K5.NC 89.52,33.92 90.6,35 103.2,35 O4.2
N$27
  Bottom 0.61: K2.NO 89.52,63.08 90.6,62 93.1,62 94.6,63.5 94.6,68 98.6,72 O1.3
N$28
  Bottom 0.61: O1.1 104.24,63.54 K2.C@1 K2.C@2
N$29
  Bottom 0.61: O1.2 97.1,68.5 96.1,67.5 96.1,63.5 93.6,61 92.06,61 K2.NC
N$30
  Bottom 0.508: 91.69,56.64 90.55,55.5
  Bottom 0.61: O2.3 103.6,60 100.24,56.64 91.69,56.64 | 90.55,55.5 89.98,55.5 K3.NO
N$31
  Bottom 0.61: O2.2 105.1,56.5 101.6,53 92.56,53 K3.NC
N$32
  Bottom 0.61: K3.C@1 101.34,55.04 104.45,58.15 106.95,58.15 107.6,57.5 107.6,54.9 O2.1 102.66,49.96 K3.C@2
N$33
  Bottom 0.61: R15.2 R14.1
N$34
  Top 0.61: T5.C 101.6,16 101.1,15.5 101.1,12.5 100.1,11.5 92.6,11.5 89.1,15 89.1,29 87.6,30.5 87.6,37 85.1,39.5 D6.A
  Bottom 0.61: K5.2 91.6,37.58 91.6,37 91.1,36.5 88.1,36.5 85.1,39.5 D6.A
N$35
  Top 0.61: T2.C 104.6,23 106.1,24.5 106.1,26 104.6,27.5 103.6,27.5 102.6,28.5 102.6,60.5 101.6,61.5 87.91,61.5 D3.A
  Bottom 0.61: D3.A 86.6,63.5 88.6,65.5 91.1,65.5 92.06,64.54 K2.2
N$36
  Top 0.61: T3.C 96.1,23 94.6,24.5 94.6,30 95.6,31 95.6,50 93.1,52.5 85.91,52.5 D4.A
  Bottom 0.61: K3.2 90.02,53 85.6,53 84.79,53.81 D4.A
N$37
  Top 0.61: T4.C 97.6,16 94.6,19 92.1,19 91.1,20 91.1,29 94.1,32 94.1,47.95 93.65,48.4 88.51,48.4 D5.A
  Bottom 0.61: K4.2 91.74,46.54 89.7,44.5 86.1,44.5 85.6,44 83.1,44 82.6,44.5 82.6,47.5 84.91,49.81 D5.A
O1
  Top 0.61: IC1.37 78.05,23.8 R21.2
O2
  Top 0.61: IC1.36 71.94,15.66 72.1,15.5 83.1,15.5 84.1,16.5 84.1,19.81 R22.1
O3
  Top 0.61: IC1.35 69.4,15.7 70.6,14.5 84.29,14.5 R23.1
O4
  Top 0.61: IC1.34 66.86,13.24 67.6,12.5 84.79,12.5 R24.1
RS_A
  Top 0.61: R6.1 78.6,65.5 77.84,64.75 IC2.6
  Bottom 0.61: RS485.2 78.35,67.79 R6.1 81.25,64.89 R5.2
RS_B
  Top 0.61: R6.2 75.6,65.5 76.57,64.53 IC2.7
  Bottom 0.61: RS485.1 74.85,67.33 R6.2 73.02,62.46 R2.1
RS_RX
  Top 0.508: 52.85,31.05 52.85,35.75
  Top 0.61: IC1.15 46.54,31.06 47.1,30.5 52.3,30.5 52.85,31.05 | 52.85,35.75 57.6,40.5 57.6,44.5 59.1,46 70.1,46 79.1,55 79.1,56.72 IC2.4
RS_TX
  Top 0.61: IC1.16 44.1,33.08 44.1,35 44.6,35.5 49.6,35.5 54.6,40.5 54.6,47 56.1,48.5 63.1,48.5 66.6,52 72.1,52 75.3,55.2 IC2.1
RS_WR
  Top 0.61: IC1.14 49.1,33 49.1,33.5 56.1,40.5 56.1,46 57.6,47.5 63.6,47.5 67.1,51 72.6,51 76.57,54.97 IC2.2 IC2.3
SIM_RS
  Bottom 0.61: U$1.RST 72.1,38.03 72.1,36.5 69.4,33.8 IC1.6
SIM_RX
  Bottom 0.61: U$1.RXD 74.6,38.67 74.6,40 74.1,40.5 65.6,40.5 65.1,40 65.1,36.5 66.86,34.74 IC1.7
SIM_TX
  Bottom 0.61: IC1.8 63.6,33.7 63.6,40.5 64.6,41.5 75.1,41.5 77.48,39.12 U$1.TXD
T_EXT
  Top 0.61: IC1.5 71.94,34.16 70.1,36 65.6,36 65.1,36.5 65.1,39.5 80.6,54.95 81.2,54.95 85.8,59.4 85.85,60.7 83.9,62.65 R10.1
  Bottom 0.61: NTC.1 83.85,69.85 R10.1
TP_VCC  (via drill 0.7 pad 1.27)
  Top 0.61: R4.1 66.07,71.85 LED1.A LED2.A | IC3.4 70.58,54.98 v70.1,54.5
  Bottom 0.61: v70.1,54.5 70.6,55 70.6,58.5 69.1,60 67.6,60 63.76,63.84 R4.1
VBAT
  Top 0.61: IC3.5 71.6,63.23 71.6,72.5 70.6,73.5 55.6,73.5 50.6,68.5 40.6,68.5 38.6,66.5 38.6,55.5 35.75,55.5 33.05,52.8 33.05,48.05 34.6,46.5 38.91,46.5 R11.2
  Bottom 0.61: R11.2 39.95,45.46 Q1.S 45.87,43.34 JP1.1 49.84,41.41 C3.+
VOUT+
  Top 0.61: D1.A 28.1,58 31.6,54.5 31.6,49.5 31.55,49.5 30.35,48.3 27.9,48.3 27.1,47.5 27.1,45.5 31.18,41.92 U$3.VOUT+
W1
  Bottom 0.61: W1.2 102.75,8.5 91.6,8.5 88.6,11.5 66.6,11.5 64.32,13.78 IC1.33
W2
  Bottom 0.61: W2.2 94.75,7.5 90.6,7.5 87.6,10.5 64.6,10.5 61.78,13.32 IC1.32
W3
  Bottom 0.61: W3.2 83.75,9.5 62.6,9.5 59.24,12.86 IC1.31
W4
  Bottom 0.61: W4.2 75.75,8.5 60.6,8.5 56.7,12.4 IC1.30
W5
  Bottom 0.61: W5.2 67.75,7.5 58.6,7.5 54.16,11.94 IC1.29

### Text on the board
Top: Mini-Alarm System | Protos 1000 | by Dawid Szromek